# Altium schematic sheet Termination Resistor.SchDoc
size A4
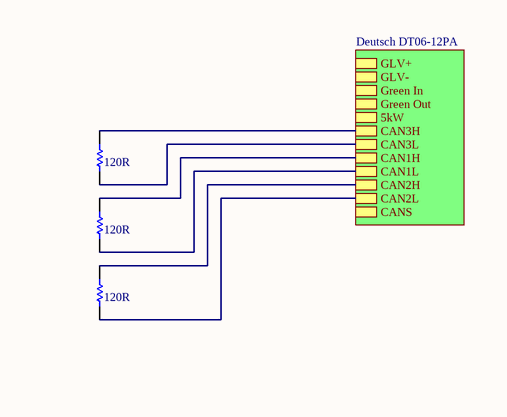
[diagram p0: Termination Resistor.SchDoc, top right]

## Parts
(Parts that share a designator on the sheet are numbered #1, #2 ... from top to bottom, then left to right.)
R?#1  value 120R  [AXIAL-0.3]  (hidden comment: Res1)
R?#2  value 120R  [AXIAL-0.3]  (hidden comment: Res1)
R?#3  value 120R  [AXIAL-0.3]  (hidden comment: Res1)

## Sub-sheets
Deutsch DT06-12PA = File Name: GLV+, GLV-, CAN1H, CAN3H, CAN3L, CAN2H, CAN1L, CAN2L, CANS, Green Out, Green In, 5kW

## Nets
NetR?#1_1: R?#1.1 ; sheet Deutsch DT06-12PA/CAN3L
NetR?#1_2: R?#1.2 ; sheet Deutsch DT06-12PA/CAN3H
NetR?#2_1: R?#2.1 ; sheet Deutsch DT06-12PA/CAN1L
NetR?#2_2: R?#2.2 ; sheet Deutsch DT06-12PA/CAN1H
NetR?#3_1: R?#3.1 ; sheet Deutsch DT06-12PA/CAN2L
NetR?#3_2: R?#3.2 ; sheet Deutsch DT06-12PA/CAN2H

## Library data of the parts
R?#1-R?#3 = Res1: Resistor; Published: 8-Jun-2000; LatestRevisionDate: 17-Jul-2002; LatestRevisionNote: Re-released for DXP Platform.; PackageReference: AXIAL-0.3; Publisher: Altium Limited; PackageDescription: Axial Device, Thru-Hole; 2 Leads; 0.3 in Pin Spacing